# EAGLE schematic 555-pwm-eagle (EAGLE 5.07)
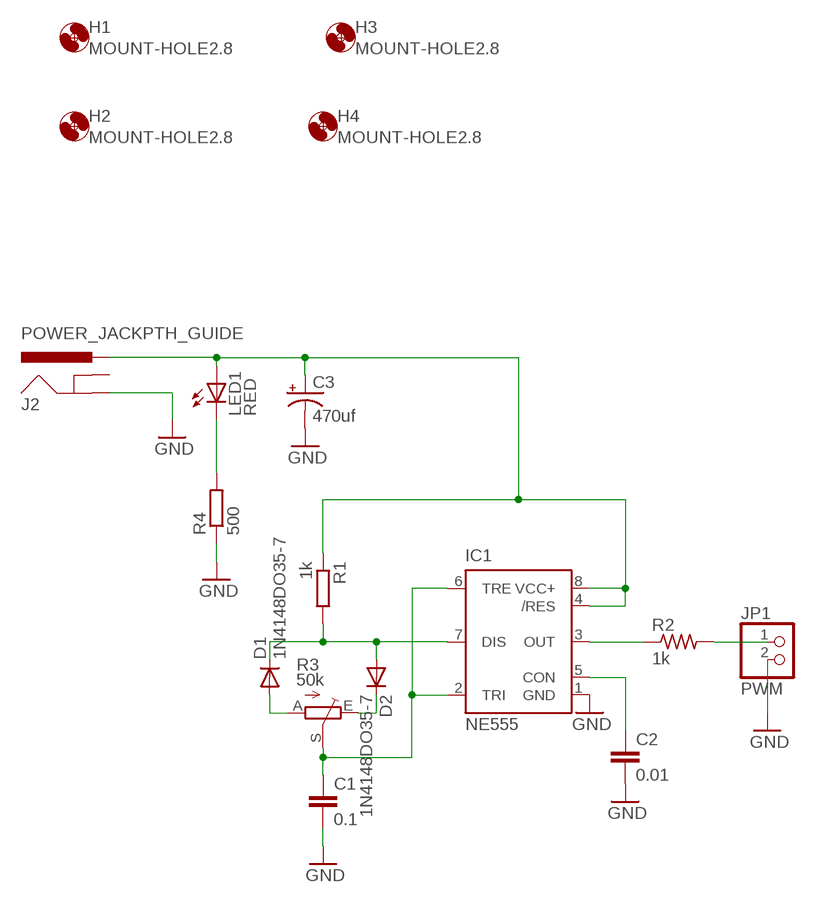
[diagram p0: schematic, sheet 1]

## Parts
C1  0.1  C-EUC0805K  [C0805K]
C2  0.01  C-EUC0805K  [C0805K]
C3  470uf  CAP_POLPTH1  [CPOL-RADIAL-100UF-25V]
D1  1N4148DO35-7  [DO35-7]
D2  1N4148DO35-7  [DO35-7]
H1  MOUNT-HOLE2.8  [2,8]
H2  MOUNT-HOLE2.8  [2,8]
H3  MOUNT-HOLE2.8  [2,8]
H4  MOUNT-HOLE2.8  [2,8]
IC1  NE555  [DIL-08]
J2  POWER_JACKPTH_GUIDE  [POWER_JAXK_2.1MMX5.5MM]
JP1  PWM  PINHD-1X2  [1X02]
LED1  RED  LEDCHIP-LED0805  [CHIP-LED0805]
R1  1k  R-EU_M0805  [M0805]
R2  1k  R-US_M0805  [M0805]
R3  50k  TRIM_EU-B64Y  [B64Y]
R4  500  R-EU_M0805  [M0805]

## Nets
GND: C1.2 C2.2 C3.2(-) IC1.1(GND) J2.GND JP1.2 R4.1
N$1: C1.1 IC1.2(TRI) IC1.6(TRE) R3.S
N$2: D1.C D2.A IC1.7(DIS) R1.2
N$4: LED1.C R4.2
N$5: JP1.1 R2.2
N$6: C2.1 IC1.5(CON)
N$7: D1.A R3.A
N$8: IC1.3(OUT) R2.1
N$9: D2.C R3.E
VCC+: C3.1(+) IC1.4(/RES) IC1.8(VCC+) J2.PWR LED1.A R1.1
Unconnected: J2.GNDBREAK

## Library data of the parts
C1 C2 = rcl:C-EU: CAPACITOR, European symbol
C3 = SparkFun:CAP_POL: Capacitor Polarized These are standard SMD and PTH capacitors. Normally 10uF, 47uF, and 100uF in electrolytic and tantalum varieties. Always verify the external diameter of the through hole cap, it varies with capacity, voltage, and manufacturer. The EIA devices should be standard.
D1 D2 = diode:1N4148: DIODE high speed (Philips)
H1-H4 = holes:MOUNT-HOLE: MOUNTING HOLE with drill center marker
IC1 = st-microelectronics:NE555: General purpose bipolar Timer
J2 = digital-toy:POWER_JACK: Power Jack This is the standard 5.5mm barrel jack for power. The PTH is the most common, proven, reliable, footprint. All others are experimental. The Slot footprint only works if the mill layer is transmitted to the PCB fab house so be warned. Spark Fun Electronics SKU : PRT-00119. Mating wall wart : TOL-00298 (and others)
JP1 = pinhead:PINHD-1X2: PIN HEADER
LED1 = led:LED: LED OSRAM: - CHIPLED LG R971, LG N971, LY N971, LG Q971, LY Q971, LO R971, LY R971 LH N974, LH R974 LS Q976, LO Q976, LY Q976 LO Q996 - Hyper CHIPLED LW Q18S LB Q993, LB Q99A, LB R99A - SideLED LS A670, LO A670, LY A670, LG A670, LP A670 LB A673, LV A673, LT A673, LW A673 LH A674 LY A675 LS A676, LA A676, LO A676, LY A676, LW A676 LS A679, LY A679, LG A679 - Hyper Micro SIDELED® LS Y876, LA Y876, LO Y876, LY Y876 LT Y87S - SmartLED LW L88C, LW L88S LB L89C, LB L89S, LG L890 LS L89K, LO L89K, LY L89K LS L896, LA L896, LO L896, LY L896 - TOPLED LS T670, LO T670, LY T670, LG T670, LP T670 LSG T670, LSP T670, LSY T670, LOP T670, LYG T670 LG T671, LOG T671, LSG T671 LB T673, LV T673, LT T673, LW T673 LH T674 LS T676, LA T676, LO T676, LY T676, LB T676, LH T676, LSB T676, LW T676 LB T67C, LV T67C, LT T67C, LS T67K, LO T67K, LY T67K, LW E67C LS E67B, LA E67B, LO E67B, LY E67B, LB E67C, LV E67C, LT E67C LW T67C LS T679, LY T679, LG T679 LS T770, LO T770, LY T770, LG T770, LP T770 LB T773, LV T773, LT T773, LW T773 LH T774 LS E675, LA E675, LY E675, LS T675 LS T776, LA T776, LO T776, LY T776, LB T776 LHGB T686 LT T68C, LB T68C - Hyper Mini TOPLED® LB M676 - Mini TOPLED Santana® LG M470 LS M47K, LO M47K, LY M47K Source: http://www.osram.convergy.de LUXEON: - LUMILED® LXK2-PW12-R00, LXK2-PW12-S00, LXK2-PW14-U00, LXK2-PW14-V00 LXK2-PM12-R00, LXK2-PM12-S00, LXK2-PM14-U00 LXK2-PE12-Q00, LXK2-PE12-R00, LXK2-PE12-S00, LXK2-PE14-T00, LXK2-PE14-U00 LXK2-PB12-K00, LXK2-PB12-L00, LXK2-PB12-M00, LXK2-PB14-N00, LXK2-PB14-P00, LXK2-PB14-Q00 LXK2-PR12-L00, LXK2-PR12-M00, LXK2-PR14-Q00, LXK2-PR14-R00 LXK2-PD12-Q00, LXK2-PD12-R00, LXK2-PD12-S00 LXK2-PH12-R00, LXK2-PH12-S00 LXK2-PL12-P00, LXK2-PL12-Q00, LXK2-PL12-R00 Source: www.luxeon.com KINGBRIGHT: KA-3528ASYC Source: www.kingbright.com
R1 R4 = rcl:R-EU_: RESISTOR, European symbol
R2 = rcl:R-US_: RESISTOR, American symbol
R3 = pot:TRIM_EU-: POTENTIOMETER